# EAGLE schematic Schematic (EAGLE 9.7.0)
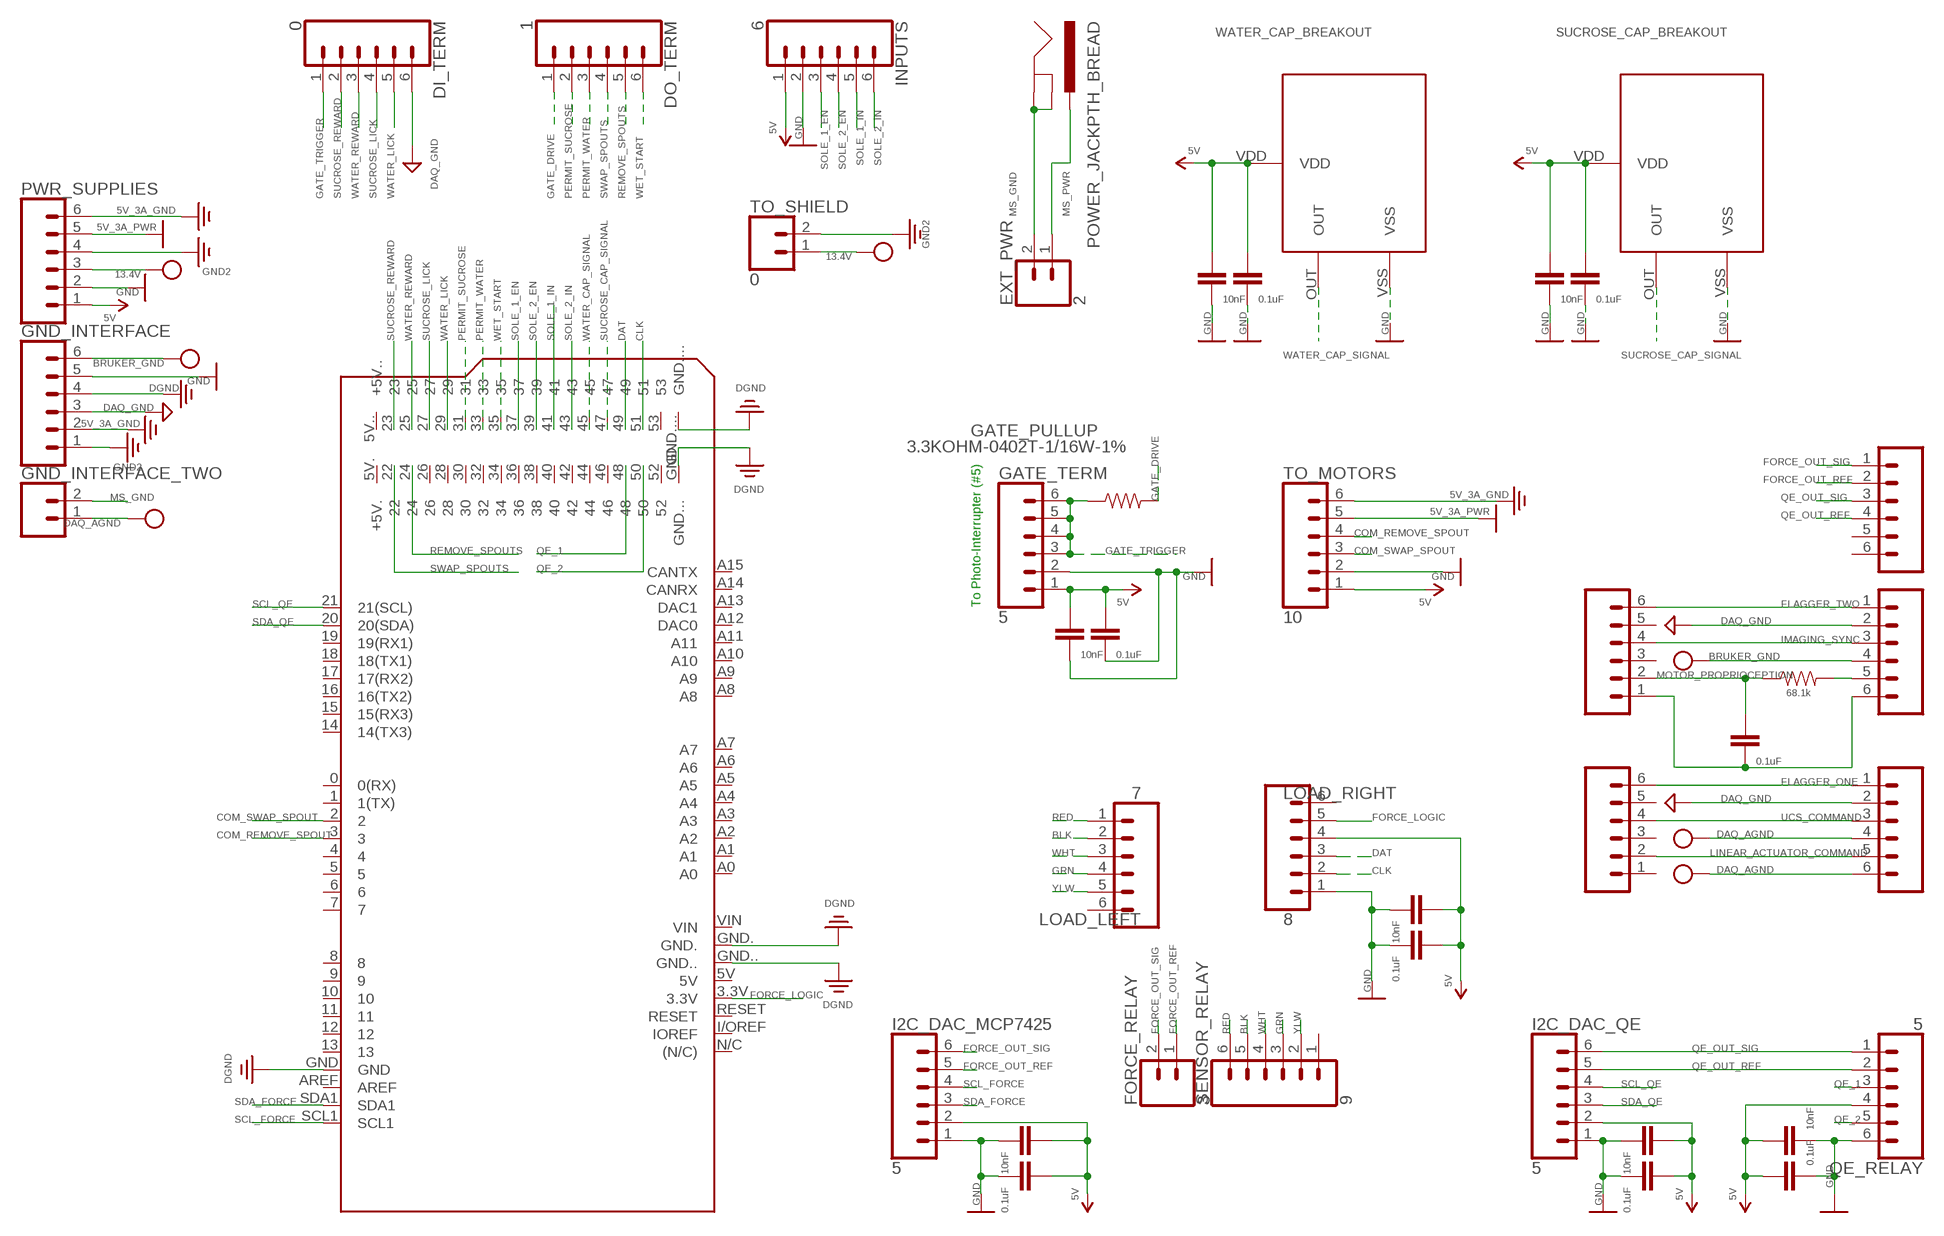
[diagram p0: schematic, sheet 1]

## Parts
BNC_RELAY_DAQ  CONN_062.54MM_SCREW_TERMINALS  [1X06_2.54MM_SCREWPIN]
BNC_RELAY_DAQ1  CONN_062.54MM_SCREW_TERMINALS  [1X06_2.54MM_SCREWPIN]
BNC_RELAY_EXT_ONE  CONN_062.54MM_SCREW_TERMINALS  [1X06_2.54MM_SCREWPIN]
BNC_RELAY_EXT_THREE  CONN_062.54MM_SCREW_TERMINALS  [1X06_2.54MM_SCREWPIN]
BNC_RELAY_EXT_TWO  CONN_062.54MM_SCREW_TERMINALS  [1X06_2.54MM_SCREWPIN]
DI_TERM  0  CONN_062.54MM_SCREW_TERMINALS  [1X06_2.54MM_SCREWPIN]
DO_TERM  1  CONN_062.54MM_SCREW_TERMINALS  [1X06_2.54MM_SCREWPIN]
EXT_PWR  2  CONN_02  [1X02]
FORCE_RELAY  3  CONN_02  [1X02]
GATE_BYPASS_1  0.1uF  0.1UF-0402T-10V-10%-X7R  [0402-TIGHT]
GATE_BYPASS_2  10nF  10NF-0402T-25V-10%-X7R-WE  [0402-TIGHT]
GATE_BYPASS_3  10nF  10NF-0402T-25V-10%-X7R-WE  [0402-TIGHT]
GATE_BYPASS_4  0.1uF  0.1UF-0402T-10V-10%-X7R  [0402-TIGHT]
GATE_BYPASS_5  10nF  10NF-0402T-25V-10%-X7R-WE  [0402-TIGHT]
GATE_BYPASS_6  0.1uF  0.1UF-0402T-10V-10%-X7R  [0402-TIGHT]
GATE_BYPASS_7  10nF  10NF-0402T-25V-10%-X7R-WE  [0402-TIGHT]
GATE_BYPASS_8  0.1uF  0.1UF-0402T-10V-10%-X7R  [0402-TIGHT]
GATE_BYPASS_9  10nF  10NF-0402T-25V-10%-X7R-WE  [0402-TIGHT]
GATE_BYPASS_10  0.1uF  0.1UF-0402T-10V-10%-X7R  [0402-TIGHT]
GATE_BYPASS_11  0.1uF  0.1UF-0402T-10V-10%-X7R  [0402-TIGHT]
GATE_PULLUP  3.3KOHM-0402T-1/16W-1%  [0402-TIGHT]
GATE_TERM  5  CONN_062.54MM_SCREW_TERMINALS  [1X06_2.54MM_SCREWPIN]
GND_INTERFACE  CONN_062.54MM_SCREW_TERMINALS  [1X06_2.54MM_SCREWPIN]
GND_INTERFACE_TWO  CONN_02  [1X02]
I2C_DAC_MCP7425  5  CONN_06NO_SILK_FEMALE_PTH  [1X06_NO_SILK]
I2C_DAC_QE  5  CONN_06NO_SILK_FEMALE_PTH  [1X06_NO_SILK]
INPUTS  6  CONN_062.54MM_SCREW_TERMINALS  [1X06_2.54MM_SCREWPIN]
LOAD_LEFT  7  CONN_06NO_SILK_FEMALE_PTH  [1X06_NO_SILK]
LOAD_RIGHT  8  CONN_06NO_SILK_FEMALE_PTH  [1X06_NO_SILK]
MOTOR_SHIELD_PWR_JACK  POWER_JACKPTH_BREAD  [POWER_JACK_PTH_BREAD]
PWR_SUPPLIES  CONN_062.54MM_SCREW_TERMINALS  [1X06_2.54MM_SCREWPIN]
QE_RELAY  5  CONN_062.54MM_SCREW_TERMINALS  [1X06_2.54MM_SCREWPIN]
R1  68.1k  68.1KOHM-0603-1/10W-1%  [0603]
REWARDS_DUE  ARDUINO_DUE  ARDUINO_DUE_F  [ARDUINO_DUE_F]
SENSOR_RELAY  9  CONN_062.54MM_SCREW_TERMINALS  [1X06_2.54MM_SCREWPIN]
SUCROSE_BYPASS_1  10nF  10NF-0402T-25V-10%-X7R-WE  [0402-TIGHT]
SUCROSE_BYPASS_CAP  0.1uF  0.1UF-0402T-10V-10%-X7R  [0402-TIGHT]
SUCROSE_CAP_BREAKOUT  AT42QT1011-MAHR  AT42QT1011_3P  [BRM-2508_VERTX]
TO_MOTORS  10  CONN_062.54MM_SCREW_TERMINALS  [1X06_2.54MM_SCREWPIN]
TO_SHIELD  0  CONN_02  [1X02]
WATER_BYPASS_2  10nF  10NF-0402T-25V-10%-X7R-WE  [0402-TIGHT]
WATER_BYPASS_CAP  0.1uF  0.1UF-0402T-10V-10%-X7R  [0402-TIGHT]
WATER_CAP_BREAKOUT  AT42QT1011-MAHR  AT42QT1011_3P  [BRM-2508_VERTX]

## Nets
3.3V: GND_INTERFACE.1 PWR_SUPPLIES.4 TO_SHIELD.2 ; supply symbol labelled GND2
5V: GATE_BYPASS_1.1 GATE_BYPASS_2.1 GATE_BYPASS_3.1 GATE_BYPASS_4.1 GATE_BYPASS_5.1 GATE_BYPASS_6.1 GATE_BYPASS_7.1 GATE_BYPASS_8.1 GATE_BYPASS_9.1 GATE_BYPASS_10.1 GATE_TERM.1 I2C_DAC_MCP7425.2 I2C_DAC_QE.2 INPUTS.1 LOAD_RIGHT.4 PWR_SUPPLIES.1 QE_RELAY.4 SUCROSE_BYPASS_1.1 SUCROSE_BYPASS_CAP.1 SUCROSE_CAP_BREAKOUT.VDD TO_MOTORS.1 WATER_BYPASS_2.1 WATER_BYPASS_CAP.1 WATER_CAP_BREAKOUT.VDD
5V_3A_GND: GND_INTERFACE.2 PWR_SUPPLIES.6 TO_MOTORS.6
5V_3A_PWR: PWR_SUPPLIES.5 TO_MOTORS.5
13.4V: PWR_SUPPLIES.3 TO_SHIELD.1
BLK: LOAD_LEFT.2 SENSOR_RELAY.5
BRUKER_GND: BNC_RELAY_EXT_TWO.4 GND_INTERFACE.6
CLK: LOAD_RIGHT.2 REWARDS_DUE.51
COM_REMOVE_SPOUT: REWARDS_DUE.3 TO_MOTORS.4
COM_SWAP_SPOUT: REWARDS_DUE.2 TO_MOTORS.3
DAQ_AGND: BNC_RELAY_EXT_ONE.4 BNC_RELAY_EXT_ONE.6 GND_INTERFACE_TWO.1
DAQ_GND: BNC_RELAY_EXT_ONE.2 BNC_RELAY_EXT_TWO.2 DI_TERM.6 GND_INTERFACE.3
DAT: LOAD_RIGHT.3 REWARDS_DUE.49
DGND: GND_INTERFACE.4 REWARDS_DUE.GND REWARDS_DUE.GND. REWARDS_DUE.GND.. REWARDS_DUE.GND... REWARDS_DUE.GND....
FLAGGER_ONE: BNC_RELAY_DAQ.6 BNC_RELAY_EXT_ONE.1
FLAGGER_TWO: BNC_RELAY_DAQ1.6 BNC_RELAY_EXT_TWO.1
FORCE_LOGIC: LOAD_RIGHT.5 REWARDS_DUE.3.3V
FORCE_OUT_REF: BNC_RELAY_EXT_THREE.2 FORCE_RELAY.1 I2C_DAC_MCP7425.5
FORCE_OUT_SIG: BNC_RELAY_EXT_THREE.1 FORCE_RELAY.2 I2C_DAC_MCP7425.6
GATE_DRIVE: DO_TERM.1 GATE_PULLUP.2
GATE_TRIGGER: DI_TERM.1 GATE_PULLUP.1 GATE_TERM.3 GATE_TERM.4 GATE_TERM.5 GATE_TERM.6
GND: GATE_BYPASS_1.2 GATE_BYPASS_2.2 GATE_BYPASS_3.2 GATE_BYPASS_4.2 GATE_BYPASS_5.2 GATE_BYPASS_6.2 GATE_BYPASS_7.2 GATE_BYPASS_8.2 GATE_BYPASS_9.2 GATE_BYPASS_10.2 GATE_TERM.2 GND_INTERFACE.5 I2C_DAC_MCP7425.1 I2C_DAC_QE.1 INPUTS.2 LOAD_RIGHT.1 PWR_SUPPLIES.2 QE_RELAY.6 SUCROSE_BYPASS_1.2 SUCROSE_BYPASS_CAP.2 SUCROSE_CAP_BREAKOUT.VSS TO_MOTORS.2 WATER_BYPASS_2.2 WATER_BYPASS_CAP.2 WATER_CAP_BREAKOUT.VSS
GRN: LOAD_LEFT.4 SENSOR_RELAY.3
IMAGING_SYNC: BNC_RELAY_DAQ1.4 BNC_RELAY_EXT_TWO.3
LINEAR_ACTUATOR_COMMAND: BNC_RELAY_DAQ.2 BNC_RELAY_EXT_ONE.5
MOTOR_PROPRIOCEPTION: BNC_RELAY_DAQ1.2 GATE_BYPASS_11.1 R1.1
MS_GND: EXT_PWR.2 GND_INTERFACE_TWO.2 MOTOR_SHIELD_PWR_JACK.GND MOTOR_SHIELD_PWR_JACK.GNDBREAK
MS_PWR: EXT_PWR.1 MOTOR_SHIELD_PWR_JACK.PWR
N$1: BNC_RELAY_EXT_TWO.5 R1.2
N$4: BNC_RELAY_DAQ1.1 BNC_RELAY_EXT_TWO.6 GATE_BYPASS_11.2
PERMIT_SUCROSE: DO_TERM.2 REWARDS_DUE.31
PERMIT_WATER: DO_TERM.3 REWARDS_DUE.33
QE_1: QE_RELAY.3 REWARDS_DUE.48
QE_2: QE_RELAY.5 REWARDS_DUE.50
QE_OUT_REF: BNC_RELAY_EXT_THREE.4 I2C_DAC_QE.5 QE_RELAY.2
QE_OUT_SIG: BNC_RELAY_EXT_THREE.3 I2C_DAC_QE.6 QE_RELAY.1
RED: LOAD_LEFT.1 SENSOR_RELAY.6
REMOVE_SPOUTS: DO_TERM.5 REWARDS_DUE.24
SCL_FORCE: I2C_DAC_MCP7425.4 REWARDS_DUE.SCL1
SCL_QE: I2C_DAC_QE.4 REWARDS_DUE.21(21(SCL))
SDA_FORCE: I2C_DAC_MCP7425.3 REWARDS_DUE.SDA1
SDA_QE: I2C_DAC_QE.3 REWARDS_DUE.20(20(SDA))
SOLE_1_EN: INPUTS.3 REWARDS_DUE.37
SOLE_1_IN: INPUTS.5 REWARDS_DUE.41
SOLE_2_EN: INPUTS.4 REWARDS_DUE.39
SOLE_2_IN: INPUTS.6 REWARDS_DUE.43
SUCROSE_CAP_SIGNAL: REWARDS_DUE.47 SUCROSE_CAP_BREAKOUT.OUT
SUCROSE_LICK: DI_TERM.4 REWARDS_DUE.27
SUCROSE_REWARD: DI_TERM.2 REWARDS_DUE.23
SWAP_SPOUTS: DO_TERM.4 REWARDS_DUE.22
UCS_COMMAND: BNC_RELAY_DAQ.4 BNC_RELAY_EXT_ONE.3
WATER_CAP_SIGNAL: REWARDS_DUE.45 WATER_CAP_BREAKOUT.OUT
WATER_LICK: DI_TERM.5 REWARDS_DUE.29
WATER_REWARD: DI_TERM.3 REWARDS_DUE.25
WET_START: DO_TERM.6 REWARDS_DUE.35
WHT: LOAD_LEFT.3 SENSOR_RELAY.4
YLW: LOAD_LEFT.5 SENSOR_RELAY.2
Unconnected: BNC_RELAY_DAQ1.3 BNC_RELAY_DAQ1.5 BNC_RELAY_DAQ.1 BNC_RELAY_DAQ.3 BNC_RELAY_DAQ.5 BNC_RELAY_EXT_THREE.5 BNC_RELAY_EXT_THREE.6 LOAD_LEFT.6 LOAD_RIGHT.6 REWARDS_DUE.0(0(RX)) REWARDS_DUE.1(1(TX)) REWARDS_DUE.4 REWARDS_DUE.5 REWARDS_DUE.5V REWARDS_DUE.5V.(+5V.) REWARDS_DUE.5V..(+5V..) REWARDS_DUE.6 REWARDS_DUE.7 REWARDS_DUE.8 REWARDS_DUE.9 REWARDS_DUE.10 REWARDS_DUE.11 REWARDS_DUE.12 REWARDS_DUE.13 REWARDS_DUE.14(14(TX3)) REWARDS_DUE.15(15(RX3)) REWARDS_DUE.16(16(TX2)) REWARDS_DUE.17(17(RX2)) REWARDS_DUE.18(18(TX1)) REWARDS_DUE.19(19(RX1)) REWARDS_DUE.26 REWARDS_DUE.28 REWARDS_DUE.30 REWARDS_DUE.32 REWARDS_DUE.34 REWARDS_DUE.36 REWARDS_DUE.38 REWARDS_DUE.40 REWARDS_DUE.42 REWARDS_DUE.44 REWARDS_DUE.46 REWARDS_DUE.52 REWARDS_DUE.53 REWARDS_DUE.A0 REWARDS_DUE.A1 REWARDS_DUE.A2 REWARDS_DUE.A3 REWARDS_DUE.A4 REWARDS_DUE.A5 REWARDS_DUE.A6 REWARDS_DUE.A7 REWARDS_DUE.A8 REWARDS_DUE.A9 REWARDS_DUE.A10 REWARDS_DUE.A11 REWARDS_DUE.A12(DAC0) REWARDS_DUE.A13(DAC1) REWARDS_DUE.A14(CANRX) REWARDS_DUE.A15(CANTX) REWARDS_DUE.AREF REWARDS_DUE.I/OREF(IOREF) REWARDS_DUE.N/C((N/C)) REWARDS_DUE.RESET REWARDS_DUE.VIN SENSOR_RELAY.1

## Notes on the sheet
- To Photo-Interrupter (#5)

## Library data of the parts
BNC_RELAY_DAQ BNC_RELAY_DAQ1 BNC_RELAY_EXT_ONE BNC_RELAY_EXT_THREE BNC_RELAY_EXT_TWO DI_TERM DO_TERM GATE_TERM GND_INTERFACE INPUTS PWR_SUPPLIES QE_RELAY SENSOR_RELAY TO_MOTORS = SparkFun-Connectors:CONN_06: Multi connection point. Often used as Generic Header-pin footprint for 0.1 inch spaced/style header connections On any of the 0.1 inch spaced packages, you can populate with these: Break Away Headers - Straight <https://www.sparkfun.com/products/116> (PRT-00116) Break Away Male Headers - Right Angle <https://www.sparkfun.com/products/553> (PRT-00553) Female Headers <https://www.sparkfun.com/products/115> (PRT-00115) Break Away Headers - Machine Pin <https://www.sparkfun.com/products/117> (PRT-00117) Break Away Female Headers - Swiss Machine Pin <https://www.sparkfun.com/products/743> (PRT-00743) Arduino Stackable Header - 6 Pin <https://www.sparkfun.com/products/9280> (PRT-09280) Screw Terminals 2.54mm Pitch (6-Pin) <https://www.sparkfun.com/products/16499> (PRT-16499) For SCREWTERMINALS and SPRING TERMINALS visit here: Screw Terimnals on SparkFun.com <https://www.sparkfun.com/search/results?term=Screw+Terminals> (5mm/3.5mm/2.54mm spacing) This device is also useful as a general connection point to wire up your design to another part of your project. Our various solder wires solder well into these plated through hole pads. Hook-Up Wire - Assortment (Stranded, 22 AWG) <https://www.sparkfun.com/products/11375> (PRT-11375) Hook-Up Wire - Assortment (Solid Core, 22 AWG) <https://www.sparkfun.com/products/11367> (PRT-11367) View the entire wire category on our website here <https://www.sparkfun.com/categories/141>; PROD_ID: CONN-14885
EXT_PWR FORCE_RELAY GND_INTERFACE_TWO TO_SHIELD = SparkFun-Connectors:CONN_02: Multi connection point. Often used as Generic Header-pin footprint for 0.1 inch spaced/style header connections On any of the 0.1 inch spaced packages, you can populate with these: Break Away Headers - Straight <https://www.sparkfun.com/products/116> (PRT-00116) Break Away Male Headers - Right Angle <https://www.sparkfun.com/products/553> (PRT-00553) Female Headers <https://www.sparkfun.com/products/115> (PRT-00115) Break Away Headers - Machine Pin <https://www.sparkfun.com/products/117> (PRT-00117) Break Away Female Headers - Swiss Machine Pin <https://www.sparkfun.com/products/743> (PRT-00743) For SCREWTERMINALS and SPRING TERMINALS visit here: Screw Terimnals on SparkFun.com <https://www.sparkfun.com/search/results?term=Screw+Terminals> (5mm/3.5mm/2.54mm spacing) This device is also useful as a general connection point to wire up your design to another part of your project. Our various solder wires solder well into these plated through hole pads. Hook-Up Wire - Assortment (Stranded, 22 AWG) <https://www.sparkfun.com/products/11375> (PRT-11375) Hook-Up Wire - Assortment (Solid Core, 22 AWG) <https://www.sparkfun.com/products/11367> (PRT-11367) View the entire wire category on our website here <https://www.sparkfun.com/categories/141> Special notes: Molex polarized connector foot print use with: PRT-08233 with associated crimp pins and housings. 2.54_SCREWTERM for use with PRT-10571. 3.5mm Screw Terminal footprints for PRT-08084 5mm Screw Terminal footprints for use with PRT-08432
GATE_BYPASS_1 GATE_BYPASS_4 GATE_BYPASS_6 GATE_BYPASS_8 GATE_BYPASS_10 GATE_BYPASS_11 SUCROSE_BYPASS_CAP WATER_BYPASS_CAP = SparkFun-RF:0.1UF: 0.1µF ceramic capacitors A capacitor is a passive two-terminal electrical component used to store electrical energy temporarily in an electric field.; PROD_ID: CAP-15083
GATE_BYPASS_2 GATE_BYPASS_3 GATE_BYPASS_5 GATE_BYPASS_7 GATE_BYPASS_9 SUCROSE_BYPASS_1 WATER_BYPASS_2 = SparkFun-Capacitors:10NF: 0.01uF/10nF/10,000pF ceramic capacitors A capacitor is a passive two-terminal electrical component used to store electrical energy temporarily in an electric field. CAP-09321; PROD_ID: CAP-16508
GATE_PULLUP = SparkFun-Resistors:3.3KOHM: 3.3kΩ resistor A resistor is a passive two-terminal electrical component that implements electrical resistance as a circuit element. Resistors act to reduce current flow, and, at the same time, act to lower voltage levels within circuits. - Wikipedia; PROD_ID: RES-15923
I2C_DAC_MCP7425 I2C_DAC_QE LOAD_LEFT LOAD_RIGHT = SparkFun-Connectors:CONN_06: Multi connection point. Often used as Generic Header-pin footprint for 0.1 inch spaced/style header connections On any of the 0.1 inch spaced packages, you can populate with these: Break Away Headers - Straight <https://www.sparkfun.com/products/116> (PRT-00116) Break Away Male Headers - Right Angle <https://www.sparkfun.com/products/553> (PRT-00553) Female Headers <https://www.sparkfun.com/products/115> (PRT-00115) Break Away Headers - Machine Pin <https://www.sparkfun.com/products/117> (PRT-00117) Break Away Female Headers - Swiss Machine Pin <https://www.sparkfun.com/products/743> (PRT-00743) Arduino Stackable Header - 6 Pin <https://www.sparkfun.com/products/9280> (PRT-09280) Screw Terminals 2.54mm Pitch (6-Pin) <https://www.sparkfun.com/products/16499> (PRT-16499) For SCREWTERMINALS and SPRING TERMINALS visit here: Screw Terimnals on SparkFun.com <https://www.sparkfun.com/search/results?term=Screw+Terminals> (5mm/3.5mm/2.54mm spacing) This device is also useful as a general connection point to wire up your design to another part of your project. Our various solder wires solder well into these plated through hole pads. Hook-Up Wire - Assortment (Stranded, 22 AWG) <https://www.sparkfun.com/products/11375> (PRT-11375) Hook-Up Wire - Assortment (Solid Core, 22 AWG) <https://www.sparkfun.com/products/11367> (PRT-11367) View the entire wire category on our website here <https://www.sparkfun.com/categories/141>; PROD_ID: CONN-08437
MOTOR_SHIELD_PWR_JACK = SparkFun-Connectors:POWER_JACK: Power Jack Connector This is the standard 5.5mm barrel jack for power. The PTH is the most common, proven, reliable, footprint. The Slot footprint only works if the mill layer is transmitted to the PCB fab house so be warned. Here are the connectors we sell at SparkFun: DC Barrel Power Jack/Connector <https://www.sparkfun.com/products/119> (PRT-00119) DC Barrel Power Jack/Connector (SMD) <https://www.sparkfun.com/products/12748> (PRT-12748) DC Barrel Jack Adapter - Breadboard Compatible <https://www.sparkfun.com/products/10811> (PRT-10811) It is used on this SparkFun product (and many, many others): SparkFun RedBoard - Programmed with Arduino <https://www.sparkfun.com/products/12757> (DEV-12757) Also, if you need a mating power supply or connector, please check these out: Wall Adapter Power Supply - 9VDC 650mA <https://www.sparkfun.com/products/298> (TOL-00298) DC Barrel Jack Adapter - Male <https://www.sparkfun.com/products/10287> (PRT-10287); PROD_ID: COMP-13253
R1 = SparkFun-Resistors:68.1KOHM: 68.1kΩ resistor A resistor is a passive two-terminal electrical component that implements electrical resistance as a circuit element. Resistors act to reduce current flow, and, at the same time, act to lower voltage levels within circuits. - Wikipedia; PROD_ID: RES-09380
REWARDS_DUE = NO_SILK:ARDUINO_DUE_F: Device for representing an Arduino Due board with a footprint in an EAGLE design. Created by Dave Young for Element14. More EAGLE documentation at: http://www.element14.com/community/community/knode/cadsoft_eagle
SUCROSE_CAP_BREAKOUT WATER_CAP_BREAKOUT = 1011MOD:AT42QT1011_3P: Atmel AT42QT1011 The AT42QT1011 (QT1011) is a digital burst mode charge-transfer (QT™) sensor that is capable of detecting nearproximityor touch, making it ideal for implementing touch controls.The QT1011 is designed specifically for human interfaces, like control panels, appliances, toys, lighting controls, or anywhere a mechanical switch or button may be found. It includes all hardware and signal processing functions necessary to provide stable sensing under a wide variety of changing conditions. Only a single low-cost capacitor is required for operation. Datasheet <https://ww1.microchip.com/downloads/en/DeviceDoc/40001947A.pdf> Sparkfun Products Sparkfun Capacitive Touch Breakout <https://www.sparkfun.com/products/14520> (SEN-14520)